# Altium schematic sheet Port_Connections.SchDoc
size A4; SheetNumber: 1; SheetTotal: 4
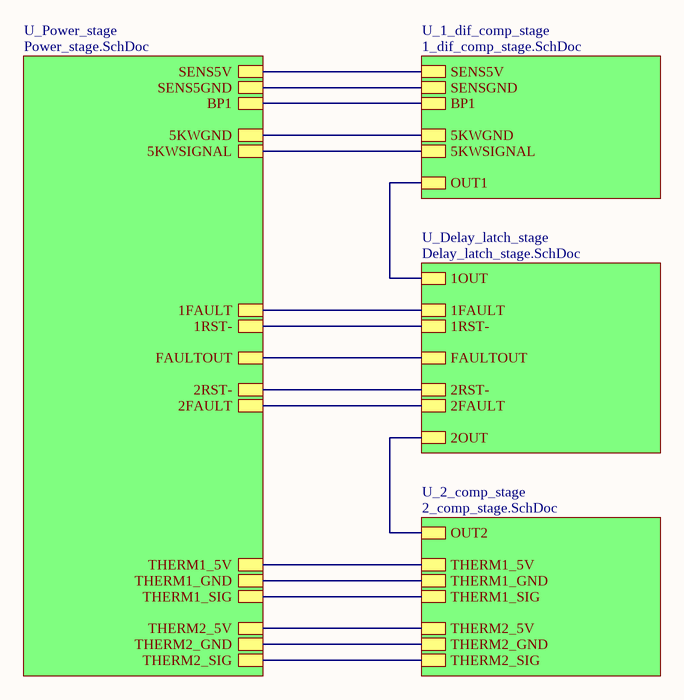
[diagram p0: Port_Connections.SchDoc]

## Sub-sheets
U_1_dif_comp_stage = 1_dif_comp_stage.SchDoc: SENS5V, SENSGND, 5KWGND, BP1, 5KWSIGNAL, OUT1
U_2_comp_stage = 2_comp_stage.SchDoc: THERM2_5V, THERM2_GND, THERM2_SIG, THERM1_SIG, THERM1_GND, THERM1_5V, OUT2
U_Delay_latch_stage = Delay_latch_stage.SchDoc: FAULTOUT, 2FAULT, 1FAULT, 1OUT, 2OUT, 1RST-, 2RST-
U_Power_stage = Power_stage.SchDoc: SENS5V, SENS5GND, BP1, 5KWSIGNAL, 5KWGND, FAULTOUT, 1RST-, 1FAULT, 2FAULT, THERM1_5V, THERM1_GND, THERM1_SIG, THERM2_5V, THERM2_GND, THERM2_SIG, 2RST-

## Nets
(unnamed): sheet U_2_comp_stage/THERM2_5V, sheet U_Power_stage/THERM2_5V
(unnamed): sheet U_2_comp_stage/THERM2_GND, sheet U_Power_stage/THERM2_GND
(unnamed): sheet U_2_comp_stage/THERM2_SIG, sheet U_Power_stage/THERM2_SIG
(unnamed): sheet U_2_comp_stage/THERM1_SIG, sheet U_Power_stage/THERM1_SIG
(unnamed): sheet U_2_comp_stage/THERM1_GND, sheet U_Power_stage/THERM1_GND
(unnamed): sheet U_2_comp_stage/THERM1_5V, sheet U_Power_stage/THERM1_5V
(unnamed): sheet U_2_comp_stage/OUT2, sheet U_Delay_latch_stage/2OUT
(unnamed): sheet U_Power_stage/SENS5V, sheet U_1_dif_comp_stage/SENS5V
(unnamed): sheet U_Power_stage/SENS5GND, sheet U_1_dif_comp_stage/SENSGND
(unnamed): sheet U_Power_stage/BP1, sheet U_1_dif_comp_stage/BP1
(unnamed): sheet U_Power_stage/5KWSIGNAL, sheet U_1_dif_comp_stage/5KWSIGNAL
(unnamed): sheet U_Power_stage/5KWGND, sheet U_1_dif_comp_stage/5KWGND
(unnamed): sheet U_Power_stage/FAULTOUT, sheet U_Delay_latch_stage/FAULTOUT
(unnamed): sheet U_Power_stage/1RST-, sheet U_Delay_latch_stage/1RST-
(unnamed): sheet U_Power_stage/1FAULT, sheet U_Delay_latch_stage/1FAULT
(unnamed): sheet U_Power_stage/2FAULT, sheet U_Delay_latch_stage/2FAULT
(unnamed): sheet U_Power_stage/2RST-, sheet U_Delay_latch_stage/2RST-
(unnamed): sheet U_Delay_latch_stage/1OUT, sheet U_1_dif_comp_stage/OUT1